# Altium schematic sheet AudioVersterkerSchema.SchDoc
size A4; SheetNumber: 1; SheetTotal: 1
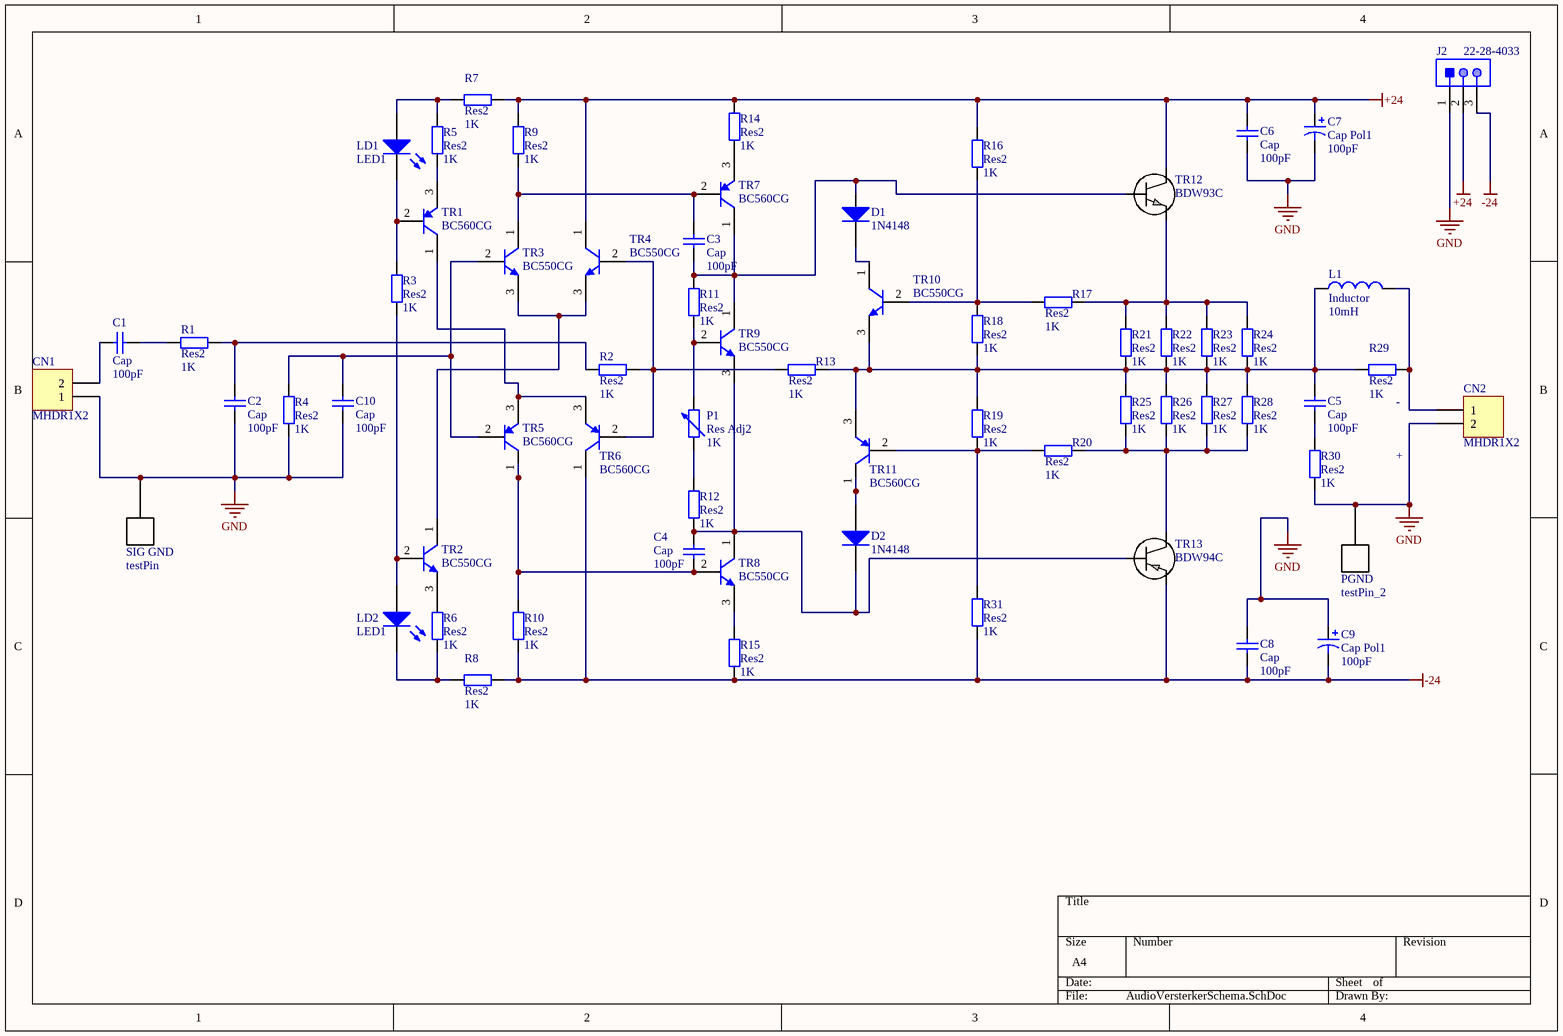
[diagram p0: AudioVersterkerSchema.SchDoc]

## Parts
C1  Cap  value 100pF  [RAD-0.3]
C2  Cap  value 100pF  [RAD-0.3]
C3  Cap  value 100pF  [RAD-0.3]
C4  Cap  value 100pF  [RAD-0.3]
C5  Cap  value 100pF  [RAD-0.3]
C6  Cap  value 100pF  [RAD-0.3]
C7  Cap Pol1  value 100pF  [RB7.6-15]
C8  Cap  value 100pF  [RAD-0.3]
C9  Cap Pol1  value 100pF  [RB7.6-15]
C10  Cap  value 100pF  [RAD-0.3]
CN1  MHDR1X2  [MHDR1X2]
CN2  MHDR1X2  [MHDR1X2]
D1  1N4148  [NXP-SOD27-2_V]
D2  1N4148  [NXP-SOD27-2_V]
J2  22-28-4033  [MOLX-22-28-4033_V]
L1  Inductor  value 10mH  [0402-A]
LD1  LED1  [LED-1]
LD2  LED1  [LED-1]
P1  Res Adj2  value 1K  [AXIAL-0.6]
PGND  testPin_2  [PIN1]
R1  Res2  value 1K  [AXIAL-0.4]
R2  Res2  value 1K  [AXIAL-0.4]
R3  Res2  value 1K  [AXIAL-0.4]
R4  Res2  value 1K  [AXIAL-0.4]
R5  Res2  value 1K  [AXIAL-0.4]
R6  Res2  value 1K  [AXIAL-0.4]
R7  Res2  value 1K  [AXIAL-0.4]
R8  Res2  value 1K  [AXIAL-0.4]
R9  Res2  value 1K  [AXIAL-0.4]
R10  Res2  value 1K  [AXIAL-0.4]
R11  Res2  value 1K  [AXIAL-0.4]
R12  Res2  value 1K  [AXIAL-0.4]
R13  Res2  value 1K  [AXIAL-0.4]
R14  Res2  value 1K  [AXIAL-0.4]
R15  Res2  value 1K  [AXIAL-0.4]
R16  Res2  value 1K  [AXIAL-0.4]
R17  Res2  value 1K  [AXIAL-0.4]
R18  Res2  value 1K  [AXIAL-0.4]
R19  Res2  value 1K  [AXIAL-0.4]
R20  Res2  value 1K  [AXIAL-0.4]
R21  Res2  value 1K  [AXIAL-0.4]
R22  Res2  value 1K  [AXIAL-0.4]
R23  Res2  value 1K  [AXIAL-0.4]
R24  Res2  value 1K  [AXIAL-0.4]
R25  Res2  value 1K  [AXIAL-0.4]
R26  Res2  value 1K  [AXIAL-0.4]
R27  Res2  value 1K  [AXIAL-0.4]
R28  Res2  value 1K  [AXIAL-0.4]
R29  Res2  value 1K  [AXIAL-0.4]
R30  Res2  value 1K  [AXIAL-0.4]
R31  Res2  value 1K  [AXIAL-0.4]
SIG_GND  testPin  [PIN1]
TR1  BC560CG  [ONSC-TO-92-3-29-11]
TR2  BC550CG  [ONSC-TO-92-3-29-11]
TR3  BC550CG  [ONSC-TO-92-3-29-11]
TR4  BC550CG  [ONSC-TO-92-3-29-11]
TR5  BC560CG  [ONSC-TO-92-3-29-11]
TR6  BC560CG  [ONSC-TO-92-3-29-11]
TR7  BC560CG  [ONSC-TO-92-3-29-11]
TR8  BC550CG  [ONSC-TO-92-3-29-11]
TR9  BC550CG  [ONSC-TO-92-3-29-11]
TR10  BC550CG  [ONSC-TO-92-3-29-11]
TR11  BC560CG  [ONSC-TO-92-3-29-11]
TR12  BDW93C  [BDW93C]
TR13  BDW94C  [BDW94C]

## Nets
+24: C6.1 C7.1 J2.2 R7.2 R9.2 R14.2 R16.2 TR4.1(C) TR12.2(C)
-24: C8.2 C9.2 J2.3 R8.2 R10.1 R15.1 R31.1 TR6.1(C) TR13.3(E)
GND: C2.2 C6.2 C7.2 C8.1 C9.1 C10.2 CN1.1 CN2.2 J2.1 PGND.?1 R4.1 R30.1 SIG_GND.?1
NetC1_1: C1.1 CN1.2
NetC1_2: C1.2 R1.1
NetC2_1: C2.1 R1.2 R2.1
NetC3_1: C3.1 R9.1 TR3.1(C) TR7.2(B)
NetC3_2: C3.2 D1.1(A) R11.2 TR7.1(C) TR9.1(C) TR12.1(B)
NetC4_1: C4.1 D2.2(K) R12.1 TR8.1(C) TR9.3(E) TR13.1(B)
NetC4_2: C4.2 R10.2 TR5.1(C) TR8.2(B)
NetC5_1: C5.1 L1.1 R13.2 R18.1 R19.2 R21.1 R22.1 R23.1 R24.1 R25.2 R26.2 R27.2 R28.2 R29.1 TR10.3(E) TR11.3(E)
NetC5_2: C5.2 R30.2
NetC10_1: C10.1 R4.2 TR3.2(B) TR5.2(B)
NetCN2_1: CN2.1 L1.2 R29.2
NetD1_2: D1.2(K) TR10.1(C)
NetD2_1: D2.1(A) TR11.1(C)
NetLD1_1: LD1.1(A) R5.2 R7.1
NetLD1_2: LD1.2(K) R3.2 TR1.2(B)
NetLD2_1: LD2.1(A) R3.1 TR2.2(B)
NetLD2_2: LD2.2(K) R6.1 R8.1
NetP1_1: P1.1 R12.2
NetP1_2: P1.2 R11.1 TR9.2(B)
NetR2_2: R2.2 R13.1 TR4.2(B) TR6.2(B)
NetR5_1: R5.1 TR1.3(E)
NetR6_2: R6.2 TR2.3(E)
NetR14_1: R14.1 TR7.3(E)
NetR15_2: R15.2 TR8.3(E)
NetR16_1: R16.1 R17.1 R18.2 TR10.2(B)
NetR17_2: R17.2 R21.2 R22.2 R23.2 R24.2 TR12.3(E)
NetR19_1: R19.1 R20.1 R31.2 TR11.2(B)
NetR20_2: R20.2 R25.1 R26.1 R27.1 R28.1 TR13.2(C)
NetTR1_1: TR1.1(C) TR5.3(E) TR6.3(E)
NetTR2_1: TR2.1(C) TR3.3(E) TR4.3(E)

## Notes on the sheet
- (near R29) -
- +

## Library data of the parts
C1-C6 C8 C10 = Cap: Capacitor; Published: 8-Jun-2000; LatestRevisionDate: 17-Jul-2002; LatestRevisionNote: Re-released for DXP Platform.; PackageReference: RAD-0.3; Publisher: Altium Limited; PackageDescription: Radial Cap, Thru-Hole; 2 Leads; 0.3 in Pin Spacing
C7 C9 = Cap Pol1: Polarized Capacitor (Radial); Published: 8-Jun-2000; LatestRevisionDate: 17-Jul-2002; LatestRevisionNote: Re-released for DXP Platform.; PackageReference: RB7.6-15; Publisher: Altium Limited; PackageDescription: Polarized Capacitor (Radial); 2 Leads
CN1 CN2 = MHDR1X2: Header, 2-Pin; LatestRevisionDate: 17-Jul-2002; LatestRevisionNote: Re-released for DXP Platform.; Publisher: Altium Limited
D1 D2 = CMP-0648-00002-1: High-speed Diode, 100 V, 450 mA, 2-Pin SOD27, RoHS; Manufacturer: NXP Semiconductors; Configuration: Single; IR (VR: 20 V)=25 nA; IFRM: 450 mA; IFSM: 4 A Max.; Trr: 4 ns Max.; Cd: 4 pF Max.; VR: 100 V Max.; VF (IF: 10 mA)=1 V; IF: 200 mA Max.; ComponentLink1Description: Manufacturer URL; RoHS: TRUE; ComponentLink1URL: http://www.nxp.com/; ComponentLink3Description: Package Specification; DatasheetVersion: Aug-04; ComponentLink2Description: Datasheet; PackageVersion: Aug-04; PackageReference: SOD27; ComponentLink3URL: http://www.nxp.com/documents/data_sheet/1N4148_1N4448.pdf; Mounting Technology: Through Hole; ComponentLink2URL: http://www.nxp.com/documents/data_sheet/1N4148_1N4448.pdf; PartNumber: 1N4148; PackageDescription: 2-Pin Hermetically Sealed Glass Package, Axial Leaded, Dia 1.85 mm, Body Length 4.25 mm, Lead Spread 25.4 mm
J2 = CMP-1676-00001-5: Male Header, Pitch 2.54 mm, 1 x 3 Position, Height 8.38 mm, Tail Length 3.18 mm, RoHS, Bulk; Manufacturer: Molex; Rows: 1; Voltage Rating: 250 V; Current Rating: 4 A; Min Operating Temperature: 0 degC; Lead Pitch: 0.1 inch; Packaging: Bulk; Contact Finish: Gold; RoHSCompliant: true; Contact Material: Brass; PackageReference: 22-28-4033; REACH SVHC: Unknown; PackageDescription: Male Header, Pitch 2.54 mm, 1 x 3 Position, Height 8.38 mm, Tail Length 3.18 mm; ComponentLink2URL: http://www.molex.com/pdm_docs/sd/022284033_sd.pdf; Height: 8.38 mm; Mounting Technology: Through Hole; ComponentLink1Description: Manufacturer URL; Length: 7.62 mm; Mount: Through Hole; DatasheetVersion: Rev. G, 01/2012; Max Operating Temperature: 75 degC; ComponentLink2Description: Datasheet; Colour: Black; Pins: 3; Contact Plating: Gold; Package Quantity: 1; ComponentLink1URL: http://www.molex.com/
L1 = Inductor: Code_IEC: 1005; Published: 8-Jun-2000; LatestRevisionDate: 29-May-2009; LatestRevisionNote: IPC-7351 Footprint Added.; PackageReference: 0402-A; Publisher: Altium Limited; PackageDescription: Chip Inductor; Code_JEITA: 0402
LD1 LD2 = LED1: Typical RED GaAs LED; Published: 8-Jun-2000; LatestRevisionDate: 08-Jul-2005; LatestRevisionNote: Mech Layer 1 removed.; PackageReference: LED-1; Publisher: Altium Limited; PackageDescription: LED; 2 Leads
P1 = Res Adj2: Variable Resistor; Set Position: 0.5; Published: 8-Jun-2000; LatestRevisionDate: 17-Jul-2002; LatestRevisionNote: Re-released for DXP Platform.; PackageReference: AXIAL-0.6; Publisher: Altium Limited; PackageDescription: Axial Device, Thru-Hole; 2 Leads; 0.6 in Pin Spacing
R1-R31 = Res2: Resistor; Published: 8-Jun-2000; LatestRevisionDate: 17-Jul-2002; LatestRevisionNote: Re-released for DXP Platform.; PackageReference: AXIAL-0.4; Publisher: Altium Limited; PackageDescription: Axial Device, Thru-Hole; 2 Leads; 0.4 in Pin Spacing
TR1 TR5 TR7 = CMP-1048-01446-1_1: Low Noise Transistor, PNP Silicon, 3-Pin TO-92, Pb-Free, Bulk Box; Manufacturer: ON Semiconductor; IC Continuous (A): -0.1; PackageDescription: 3-Pin Transistor Outline, Body 4.825 x 3.685 mm, Pitch 1.27 mm; ComponentLink1Description: Manufacturer URL; ComponentLink2URL: http://www.onsemi.com/pub_link/Collateral/BC560C-D.PDF; Mounting Technology: Through Hole; DatasheetVersion: Rev. 4; Packing: Bulk Box; PartNumber: BC560CG; ComponentLink3Description: Package Specification; ComponentLink2Description: Datasheet; PackageVersion: Rev. AM; Polarity: PNP; ComponentLink1URL: http://www.onsemi.com/; PackageReference: TO-92-3-29-11_AM_SL; ComponentLink3URL: http://www.onsemi.cn/pub_link/Collateral/2N6426-D.PDF; RoHS: TRUE; Manufacturer Part Number: BC560CG
TR2 TR3 TR8 TR9 = CMP-1048-01461-1: Low Noise Transistor, NPN Silicon, 3-Pin TO-92, Pb-Free, Bulk Box; Manufacturer: On Semiconductor; IC Continuous (A): 0.1; ComponentLink1URL: http://www.onsemi.com/; DatasheetVersion: Rev. 2; ComponentLink1Description: Manufacturer URL; Mounting Technology: Through Hole; PackageVersion: Rev. AM; PackageReference: TO-92-3-29-11_AM_SL; PackageDescription: 3-Pin Transistor Outline, Body 4.825 x 3.685 mm, Pitch 1.27 mm; PartNumber: BC550CG; ComponentLink2Description: Datasheet; ComponentLink3Description: Package Specification; ComponentLink3URL: http://www.onsemi.cn/pub_link/Collateral/2N6426-D.PDF; RoHS: TRUE; Packing: Bulk Box; ComponentLink2URL: http://www.onsemi.com/pub_link/Collateral/BC550C-D.PDF; Polarity: NPN
TR4 TR10 = CMP-1048-01461-1_1: Low Noise Transistor, NPN Silicon, 3-Pin TO-92, Pb-Free, Bulk Box; Manufacturer: ON Semiconductor; IC Continuous (A): 0.1; ComponentLink1URL: http://www.onsemi.com/; DatasheetVersion: Rev. 2; ComponentLink1Description: Manufacturer URL; Mounting Technology: Through Hole; PackageVersion: Rev. AM; PackageReference: TO-92-3-29-11_AM_SL; PackageDescription: 3-Pin Transistor Outline, Body 4.825 x 3.685 mm, Pitch 1.27 mm; PartNumber: BC550CG; ComponentLink2Description: Datasheet; ComponentLink3Description: Package Specification; ComponentLink3URL: http://www.onsemi.cn/pub_link/Collateral/2N6426-D.PDF; RoHS: TRUE; Packing: Bulk Box; ComponentLink2URL: http://www.onsemi.com/pub_link/Collateral/BC550C-D.PDF; Polarity: NPN; Manufacturer Part Number: BC550CG
TR6 TR11 = CMP-1048-01446-1: Low Noise Transistor, PNP Silicon, 3-Pin TO-92, Pb-Free, Bulk Box; Manufacturer: On Semiconductor; IC Continuous (A): -0.1; PackageDescription: 3-Pin Transistor Outline, Body 4.825 x 3.685 mm, Pitch 1.27 mm; ComponentLink1Description: Manufacturer URL; ComponentLink2URL: http://www.onsemi.com/pub_link/Collateral/BC560C-D.PDF; Mounting Technology: Through Hole; DatasheetVersion: Rev. 4; Packing: Bulk Box; PartNumber: BC560CG; ComponentLink3Description: Package Specification; ComponentLink2Description: Datasheet; PackageVersion: Rev. AM; Polarity: PNP; ComponentLink1URL: http://www.onsemi.com/; PackageReference: TO-92-3-29-11_AM_SL; ComponentLink3URL: http://www.onsemi.cn/pub_link/Collateral/2N6426-D.PDF; RoHS: TRUE
TR12 = BDW93C: No Description Available; Vendor: STMicroelectronics; Built_By: EMA_UL_Team; SourceLibrary: Updates_to_database_2020-11-02; Type: DEV; Manufacturer_Part_Number: BDW93C; Copyright: Copyright (C) 2018 Accelerated Designs. All rights reserved; RefDes: RefDes
TR13 = BDW94C: No Description Available; Vendor: STMicroelectronics; Built_By: EMA_UL_Team; SourceLibrary: Updates_to_database_2020-11-02; Type: DEV; Manufacturer_Part_Number: BDW94C; Copyright: Copyright (C) 2018 Accelerated Designs. All rights reserved; RefDes: RefDes